# EAGLE schematic BQ25504 (EAGLE 9.6.1)
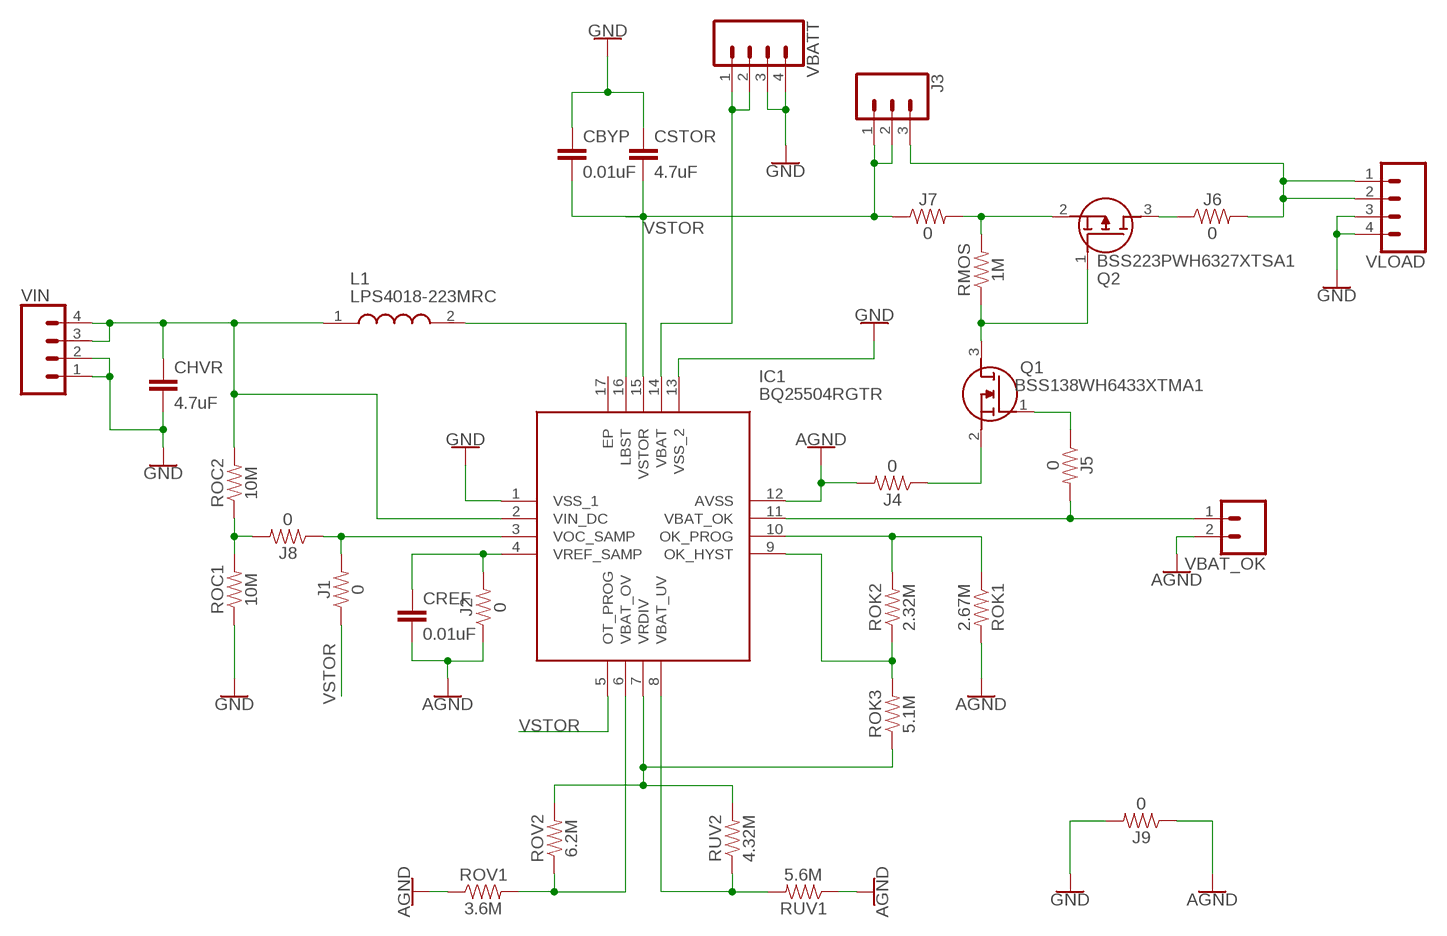
[diagram p0: schematic, sheet 1]

## Parts
CBYP  0.01uF  CAP-0603  [0603]
CHVR  4.7uF  CAP-0603  [0603]
CREF  0.01uF  CAP-0603  [0603]
CSTOR  4.7uF  CAP-0603  [0603]
IC1  BQ25504RGTR  [QFN50P300X300X100-17N]
J1  0  RESISTOR0402  [0402]
J2  0  RESISTOR0402  [0402]
J3  CONN_03  [1X03]
J4  0  RESISTOR0402  [0402]
J5  0  RESISTOR0402  [0402]
J6  0  RESISTOR0402  [0402]
J7  0  RESISTOR0402  [0402]
J8  0  RESISTOR0402  [0402]
J9  0  RESISTOR0402  [0402]
L1  LPS4018-223MRC  [LPS4018223MRC]
Q1  BSS138WH6433XTMA1  [SOT65P210X100-3N]
Q2  BSS223PWH6327XTSA1  [SOT65P210X100-3N]
RMOS  1M  RESISTOR0603  [0603]
ROC1  10M  RESISTOR0603  [0603]
ROC2  10M  RESISTOR0603  [0603]
ROK1  2.67M  RESISTOR0603  [0603]
ROK2  2.32M  RESISTOR0603  [0603]
ROK3  5.1M  RESISTOR0603  [0603]
ROV1  3.6M  RESISTOR0603  [0603]
ROV2  6.2M  RESISTOR0603  [0603]
RUV1  5.6M  RESISTOR0603  [0603]
RUV2  4.32M  RESISTOR0603  [0603]
VBAT_OK  CONN_02  [1X02]
VBATT  CONN_04PTH  [1X04]
VIN  CONN_04PTH  [1X04]
VLOAD  CONN_04PTH  [1X04]

## Nets
AGND: CREF.2 IC1.12(AVSS) J2.1 J4.2 J9.1 ROK1.2 ROV1.1 RUV1.1 VBAT_OK.2
GND: CBYP.1 CHVR.2 CSTOR.1 IC1.1(VSS_1) IC1.13(VSS_2) J9.2 ROC1.1 VBATT.3 VBATT.4 VIN.1 VIN.2 VLOAD.3 VLOAD.4
N$1: CREF.1 IC1.4(VREF_SAMP) J2.2
N$2: CHVR.1 IC1.2(VIN_DC) L1.1 ROC2.2 VIN.3 VIN.4
N$3: J8.2 ROC1.2 ROC2.1
N$4: IC1.7(VRDIV) ROK3.1 ROV2.2 RUV2.2
N$5: IC1.6(VBAT_OV) ROV1.2 ROV2.1
N$6: IC1.8(VBAT_UV) RUV1.2 RUV2.1
N$7: J4.1 Q1.2(S)
N$8: IC1.11(VBAT_OK) J5.2 VBAT_OK.1
N$9: IC1.9(OK_HYST) ROK2.1 ROK3.2
N$10: IC1.10(OK_PROG) ROK1.1 ROK2.2
N$11: IC1.16(LBST) L1.2
N$12: J3.3 J6.2 VLOAD.1 VLOAD.2
N$13: Q1.3(D) Q2.1(G) RMOS.1
N$14: J5.1 Q1.1(G)
N$15: IC1.14(VBAT) VBATT.1 VBATT.2
N$16: J7.2 Q2.2(S) RMOS.2
N$17: J6.1 Q2.3(D)
N$18: IC1.3(VOC_SAMP) J1.2 J8.1
VSTOR: CBYP.2 CSTOR.2 IC1.5(OT_PROG) IC1.15(VSTOR) J1.1 J3.1 J3.2 J7.1
Unconnected: IC1.17(EP)

## Library data of the parts
CBYP CHVR CREF CSTOR = SparkFun-Capacitors:CAP
IC1 = BQ25504RGTR:BQ25504RGTR: Ultra Low Power Boost Converter with Battery Management for Energy Harvester | Nano-Power Management Source: Datasheet <https://www.ti.com/lit/ds/symlink/bq25504.pdf?ts=1607081282078&ref_url=https%3A%2F%2Fwww.ti.com%2Fstore%2Fti%2Fen%2Fp%2Fproduct%2F%3Fp%3DBQ25504RGTR%26keyMatch%3DBQ25504RGTR%26tisearch%3DSearch-EN-everything%26usecase%3DO>; ARROW_PART_NUMBER: BQ25504RGTR; ARROW_PRICE-STOCK: https://www.arrow.com/en/products/bq25504rgtr/texas-instruments; DESCRIPTION: Ultra Low Power Boost Converter with Battery Management for Energy Harvester | Nano-Power Management; HEIGHT: 1mm; MANUFACTURER_NAME: Texas Instruments; MANUFACTURER_PART_NUMBER: BQ25504RGTR; MOUSER_PART_NUMBER: 595-BQ25504RGTR; MOUSER_PRICE-STOCK: https://www.mouser.co.uk/ProductDetail/Texas-Instruments/BQ25504RGTR?qs=LDM2r2BBpna1ocxRvQkZ2w%3D%3D
J1 J2 J4-J9 RMOS ROC1 ROC2 ROK1-ROK3 ROV1 ROV2 RUV1 RUV2 = SparkFun-Resistors:RESISTOR: Generic Resistor Package
J3 = SparkFun-Connectors:CONN_03: Multi connection point. Often used as Generic Header-pin footprint for 0.1 inch spaced/style header connections On any of the 0.1 inch spaced packages, you can populate with these: Break Away Headers - Straight <https://www.sparkfun.com/products/116> (PRT-00116) Break Away Male Headers - Right Angle <https://www.sparkfun.com/products/553> (PRT-00553) Female Headers <https://www.sparkfun.com/products/115> (PRT-00115) Break Away Headers - Machine Pin <https://www.sparkfun.com/products/117> (PRT-00117) Break Away Female Headers - Swiss Machine Pin <https://www.sparkfun.com/products/743> (PRT-00743) Stackable Header - 3 Pin (Female, 0.1") <https://www.sparkfun.com/products/13875> (PRT-13875) For SCREWTERMINALS and SPRING TERMINALS visit here: Screw Terimnals on SparkFun.com <https://www.sparkfun.com/search/results?term=Screw+Terminals> (5mm/3.5mm/2.54mm spacing) This device is also useful as a general connection point to wire up your design to another part of your project. Our various solder wires solder well into these plated through hole pads. Hook-Up Wire - Assortment (Stranded, 22 AWG) <https://www.sparkfun.com/products/11375> (PRT-11375) Hook-Up Wire - Assortment (Solid Core, 22 AWG) <https://www.sparkfun.com/products/11367> (PRT-11367) View the entire wire category on our website here <https://www.sparkfun.com/categories/141> Special notes: Molex polarized connector foot print use with SKU : PRT-08232 with associated crimp pins and housings.; PROD_ID: XXX-00000; VALUE: 455-1750-1-ND
L1 = LPS4018-223MRC:LPS4018-223MRC: Fixed Inductors LPS4018 Low Profile 22uH 0.9A 20% SMD Source: Datasheet <https://www.coilcraft.com/pdfs/lps4018.pdf>; DESCRIPTION: Fixed Inductors LPS4018 Low Profile 22uH 0.9A 20% SMD; HEIGHT: 1.8mm; MANUFACTURER_NAME: COILCRAFT; MANUFACTURER_PART_NUMBER: LPS4018-223MRC; MOUSER_PART_NUMBER: 994-LPS4018-223MRC; MOUSER_PRICE-STOCK: https://www.mouser.co.uk/ProductDetail/Coilcraft/LPS4018-223MRC?qs=QQJxVsr8EGZ1iTyTHMP0jg%3D%3D
Q1 = BSS138WH6433XTMA1:BSS138WH6433XTMA1: Infineon BSS138WH6433XTMA1 N-channel MOSFET Transistor, 0.28 A, 60 V, 3-Pin SOT-323 Source: Datasheet <http://uk.rs-online.com/web/p/products/8269282P>; ARROW_PART_NUMBER: BSS138WH6433XTMA1; ARROW_PRICE-STOCK: https://www.arrow.com/en/products/bss138wh6433xtma1/infineon-technologies-ag; DESCRIPTION: Infineon BSS138WH6433XTMA1 N-channel MOSFET Transistor, 0.28 A, 60 V, 3-Pin SOT-323; HEIGHT: 1mm; MANUFACTURER_NAME: Infineon; MANUFACTURER_PART_NUMBER: BSS138WH6433XTMA1; MOUSER_PART_NUMBER: 726-BSS138WH6433XTMA; MOUSER_PRICE-STOCK: https://www.mouser.co.uk/ProductDetail/Infineon-Technologies/BSS138WH6433XTMA1?qs=Dj8dEyEphkNlA40XmWLzSg%3D%3D
Q2 = BSS223PWH6327XTSA1:BSS223PWH6327XTSA1: Infineon BSS223PWH6327XTSA1 P-channel MOSFET Transistor, 0.31 A, -20 V, 3-Pin SOT-323 Source: Datasheet <https://componentsearchengine.com/Datasheets/2/BSS223PWH6327XTSA1.pdf>; ARROW_PART_NUMBER: BSS223PWH6327XTSA1; ARROW_PRICE-STOCK: https://www.arrow.com/en/products/bss223pwh6327xtsa1/infineon-technologies-ag; DESCRIPTION: Infineon BSS223PWH6327XTSA1 P-channel MOSFET Transistor, 0.31 A, -20 V, 3-Pin SOT-323; HEIGHT: 1mm; MANUFACTURER_NAME: Infineon; MANUFACTURER_PART_NUMBER: BSS223PWH6327XTSA1; MOUSER_PART_NUMBER: 726-BSS223PWH6327XTS; MOUSER_PRICE-STOCK: https://www.mouser.co.uk/ProductDetail/Infineon-Technologies/BSS223PWH6327XTSA1?qs=Dj8dEyEphkMhtpM4HseAjA%3D%3D
VBAT_OK = SparkFun-Connectors:CONN_02: Multi connection point. Often used as Generic Header-pin footprint for 0.1 inch spaced/style header connections On any of the 0.1 inch spaced packages, you can populate with these: Break Away Headers - Straight <https://www.sparkfun.com/products/116> (PRT-00116) Break Away Male Headers - Right Angle <https://www.sparkfun.com/products/553> (PRT-00553) Female Headers <https://www.sparkfun.com/products/115> (PRT-00115) Break Away Headers - Machine Pin <https://www.sparkfun.com/products/117> (PRT-00117) Break Away Female Headers - Swiss Machine Pin <https://www.sparkfun.com/products/743> (PRT-00743) For SCREWTERMINALS and SPRING TERMINALS visit here: Screw Terimnals on SparkFun.com <https://www.sparkfun.com/search/results?term=Screw+Terminals> (5mm/3.5mm/2.54mm spacing) This device is also useful as a general connection point to wire up your design to another part of your project. Our various solder wires solder well into these plated through hole pads. Hook-Up Wire - Assortment (Stranded, 22 AWG) <https://www.sparkfun.com/products/11375> (PRT-11375) Hook-Up Wire - Assortment (Solid Core, 22 AWG) <https://www.sparkfun.com/products/11367> (PRT-11367) View the entire wire category on our website here <https://www.sparkfun.com/categories/141> Special notes: Molex polarized connector foot print use with: PRT-08233 with associated crimp pins and housings. 2.54_SCREWTERM for use with PRT-10571. 3.5mm Screw Terminal footprints for PRT-08084 5mm Screw Terminal footprints for use with PRT-08432
VBATT VIN VLOAD = SparkFun-Connectors:CONN_04: Multi connection point. Often used as Generic Header-pin footprint for 0.1 inch spaced/style header connections On any of the 0.1 inch spaced packages, you can populate with these: Break Away Headers - Straight <https://www.sparkfun.com/products/116> (PRT-00116) Break Away Male Headers - Right Angle <https://www.sparkfun.com/products/553> (PRT-00553) Female Headers <https://www.sparkfun.com/products/115> (PRT-00115) Break Away Headers - Machine Pin <https://www.sparkfun.com/products/117> (PRT-00117) Break Away Female Headers - Swiss Machine Pin <https://www.sparkfun.com/products/743> (PRT-00743) For SCREWTERMINALS and SPRING TERMINALS visit here: Screw Terimnals on SparkFun.com <https://www.sparkfun.com/search/results?term=Screw+Terminals> (5mm/3.5mm/2.54mm spacing) This device is also useful as a general connection point to wire up your design to another part of your project. Our various solder wires solder well into these plated through hole pads. Hook-Up Wire - Assortment (Stranded, 22 AWG) <https://www.sparkfun.com/products/11375> (PRT-11375) Hook-Up Wire - Assortment (Solid Core, 22 AWG) <https://www.sparkfun.com/products/11367> (PRT-11367) View the entire wire category on our website here <https://www.sparkfun.com/categories/141> Special notes: Molex polarized connector foot print use with SKU : PRT-08231 with associated crimp pins and housings. 1MM SMD Version SKU: PRT-10208; PROD_ID: CONN-09696